# EAGLE design mMWCv0.2 (EAGLE 6.2)
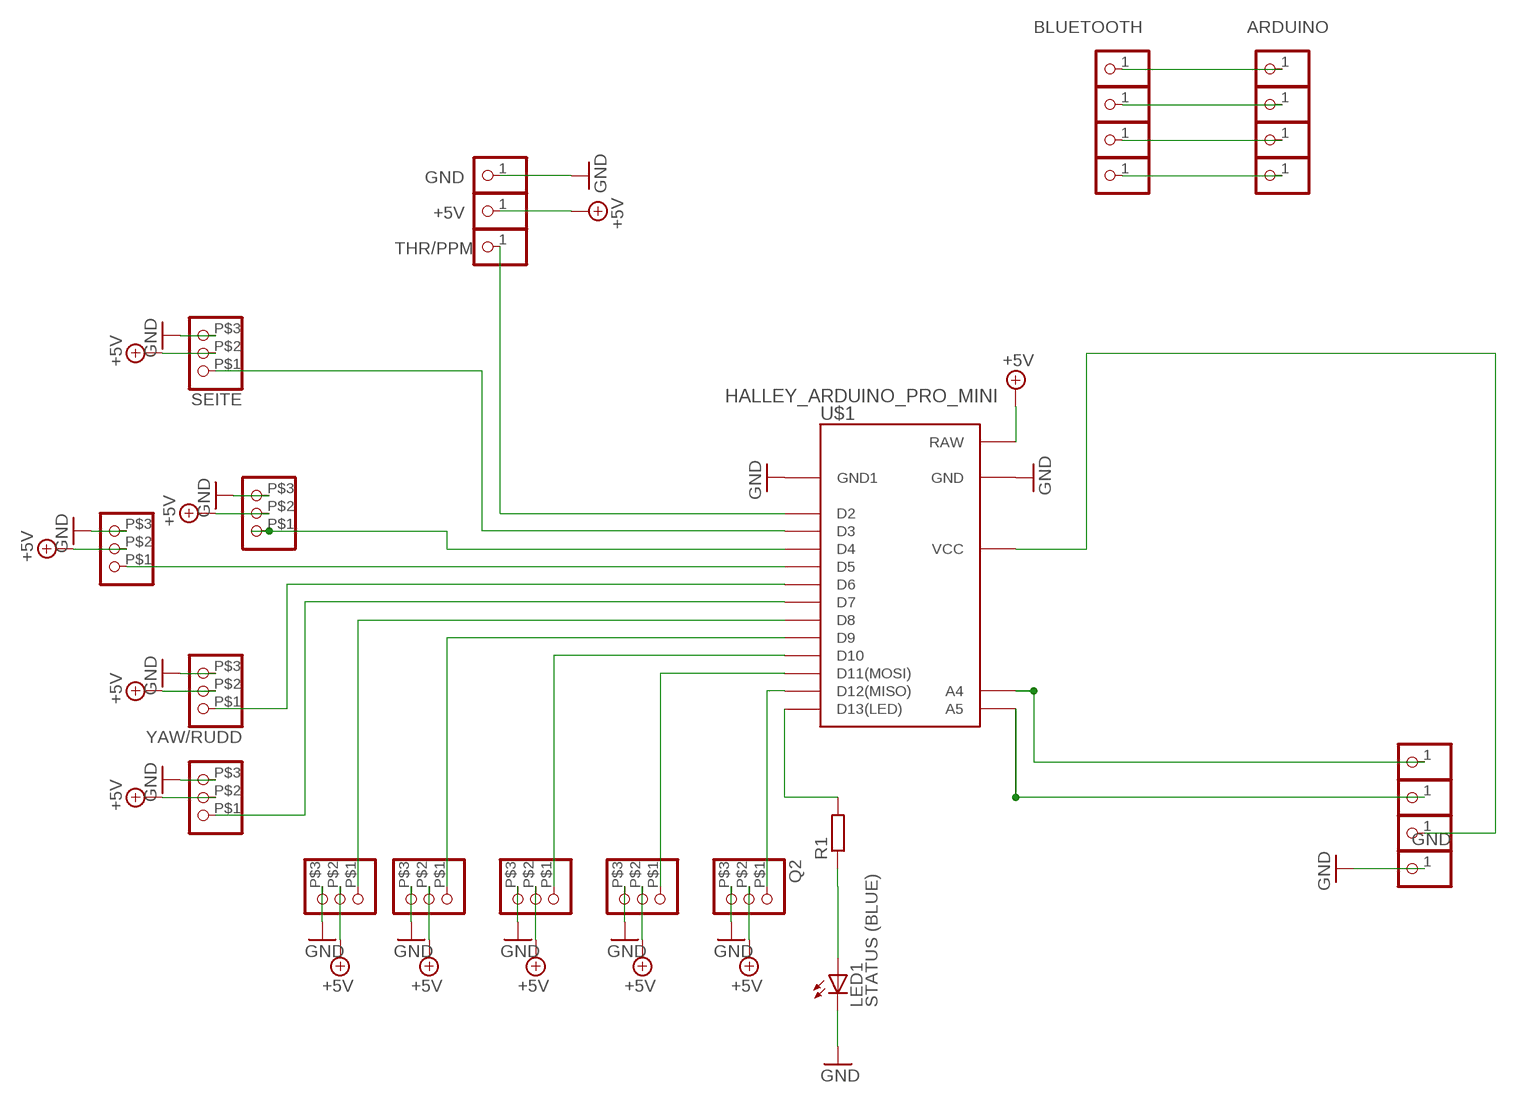
[diagram p0: schematic, sheet 1]

## Parts
5V  PINHD-1X1  [1X01]
+5V  PINHD-1X1  [1X01]
A4  PINHD-1X1  [1X01]
A5  PINHD-1X1  [1X01]
AIL  PINHEAD_PINHD-1X3  [PINHEAD_1X03]
ARD_GND  PINHD-1X1  [1X01]
ARD_RX  PINHD-1X1  [1X01]
ARD_TX  PINHD-1X1  [1X01]
ARD_VCC  GND  PINHD-1X1  [1X01]
AUX2  PINHEAD_PINHD-1X3  [PINHEAD_1X03]
BT_GND  PINHD-1X1  [1X01]
BT_RX  PINHD-1X1  [1X01]
BT_TX  PINHD-1X1  [1X01]
BT_VCC  GND  PINHD-1X1  [1X01]
ELE/PITCH  PINHEAD_PINHD-1X3  [PINHEAD_1X03]
GND  PINHD-1X1  [1X01]
GND_  GND  PINHD-1X1  [1X01]
HÖHE  PINHEAD_PINHD-1X3  [PINHEAD_1X03]
LED1  STATUS (BLUE)  LEDCHIPLED_1206  [CHIPLED_1206]
MODE  PINHEAD_PINHD-1X3  [PINHEAD_1X03]
MOTOR  PINHEAD_PINHD-1X3  [PINHEAD_1X03]
Q1  PINHEAD_PINHD-1X3  [PINHEAD_1X03]
Q2  PINHEAD_PINHD-1X3  [PINHEAD_1X03]
R1  R-EU_R1206  [R1206]
SEITE  PINHEAD_PINHD-1X3  [PINHEAD_1X03]
THR/PPM  PINHD-1X1  [1X01]
U$1  HALLEY_ARDUINO_PRO_MINI  [HALLEY_ARDUINO_PRO_MINI]
YAW/RUDD  PINHEAD_PINHD-1X3  [PINHEAD_1X03]

## Nets
+5V [Power]: +5V.1 AIL.P$2 AUX2.P$2 ELE/PITCH.P$2 HÖHE.P$2 MODE.P$2 MOTOR.P$2 Q1.P$2 Q2.P$2 SEITE.P$2 U$1.RAW YAW/RUDD.P$2
BT_ARD_GND: ARD_GND.1 BT_GND.1
BT_ARD_VCC: ARD_VCC.1 BT_VCC.1
GND [Ground]: AIL.P$3 AUX2.P$3 ELE/PITCH.P$3 GND.1 GND_.1 HÖHE.P$3 LED1.C MODE.P$3 MOTOR.P$3 Q1.P$3 Q2.P$3 SEITE.P$3 U$1.GND1(GND) U$1.GND(GND1) YAW/RUDD.P$3
N$1: THR/PPM.1 U$1.D2
N$2: AIL.P$1 U$1.D4
N$3: SEITE.P$1 U$1.D3
N$4: ELE/PITCH.P$1 U$1.D5
N$5: MODE.P$1 U$1.D7
N$6: Q2.P$1 U$1.D12(D12(MISO))
N$7: AUX2.P$1 U$1.D8
N$8: A4.1 U$1.A4
N$9: R1.2 U$1.D13(D13(LED))
N$10: U$1.D6 YAW/RUDD.P$1
N$11: MOTOR.P$1 U$1.D9
N$12: HÖHE.P$1 U$1.D10
N$13: Q1.P$1 U$1.D11(D11(MOSI))
N$16: LED1.A R1.1
N$17 [Power]: 5V.1 U$1.VCC
N$19: A5.1 U$1.A5
N$20: ARD_RX.1 BT_TX.1
N$21: ARD_TX.1 BT_RX.1

## Notes on the sheet
- BLUETOOTH | ARDUINO

## Library data of the parts
5V +5V A4 A5 ARD_GND ARD_RX ARD_TX ARD_VCC BT_GND BT_RX BT_TX BT_VCC GND GND_ THR/PPM = pinhead:PINHD-1X1: PIN HEADER
AIL AUX2 ELE/PITCH HÖHE MODE MOTOR Q1 Q2 SEITE YAW/RUDD = koneMWC_MiniShield_minimalistic_rearranged:PINHEAD_PINHD-1X3: PIN HEADER
LED1 = led:LED: LED OSRAM: - CHIPLED LG R971, LG N971, LY N971, LG Q971, LY Q971, LO R971, LY R971 LH N974, LH R974 LS Q976, LO Q976, LY Q976 LO Q996 - Hyper CHIPLED LW Q18S LB Q993, LB Q99A, LB R99A - SideLED LS A670, LO A670, LY A670, LG A670, LP A670 LB A673, LV A673, LT A673, LW A673 LH A674 LY A675 LS A676, LA A676, LO A676, LY A676, LW A676 LS A679, LY A679, LG A679 - Hyper Micro SIDELED® LS Y876, LA Y876, LO Y876, LY Y876 LT Y87S - SmartLED LW L88C, LW L88S LB L89C, LB L89S, LG L890 LS L89K, LO L89K, LY L89K LS L896, LA L896, LO L896, LY L896 - TOPLED LS T670, LO T670, LY T670, LG T670, LP T670 LSG T670, LSP T670, LSY T670, LOP T670, LYG T670 LG T671, LOG T671, LSG T671 LB T673, LV T673, LT T673, LW T673 LH T674 LS T676, LA T676, LO T676, LY T676, LB T676, LH T676, LSB T676, LW T676 LB T67C, LV T67C, LT T67C, LS T67K, LO T67K, LY T67K, LW E67C LS E67B, LA E67B, LO E67B, LY E67B, LB E67C, LV E67C, LT E67C LW T67C LS T679, LY T679, LG T679 LS T770, LO T770, LY T770, LG T770, LP T770 LB T773, LV T773, LT T773, LW T773 LH T774 LS E675, LA E675, LY E675, LS T675 LS T776, LA T776, LO T776, LY T776, LB T776 LHGB T686 LT T68C, LB T68C - Hyper Mini TOPLED® LB M676 - Mini TOPLED Santana® LG M470 LS M47K, LO M47K, LY M47K Source: http://www.osram.convergy.de LUXEON: - LUMILED® LXK2-PW12-R00, LXK2-PW12-S00, LXK2-PW14-U00, LXK2-PW14-V00 LXK2-PM12-R00, LXK2-PM12-S00, LXK2-PM14-U00 LXK2-PE12-Q00, LXK2-PE12-R00, LXK2-PE12-S00, LXK2-PE14-T00, LXK2-PE14-U00 LXK2-PB12-K00, LXK2-PB12-L00, LXK2-PB12-M00, LXK2-PB14-N00, LXK2-PB14-P00, LXK2-PB14-Q00 LXK2-PR12-L00, LXK2-PR12-M00, LXK2-PR14-Q00, LXK2-PR14-R00 LXK2-PD12-Q00, LXK2-PD12-R00, LXK2-PD12-S00 LXK2-PH12-R00, LXK2-PH12-S00 LXK2-PL12-P00, LXK2-PL12-Q00, LXK2-PL12-R00 Source: www.luxeon.com KINGBRIGHT: KA-3528ASYC Source: www.kingbright.com
R1 = rcl:R-EU_: RESISTOR, European symbol
U$1 = mMWCa:HALLEY_ARDUINO_PRO_MINI

## Net classes
0 Signal: width 0.61 mm
1 Ground: width 0.813 mm
2 Power: width 0.813 mm

## Board
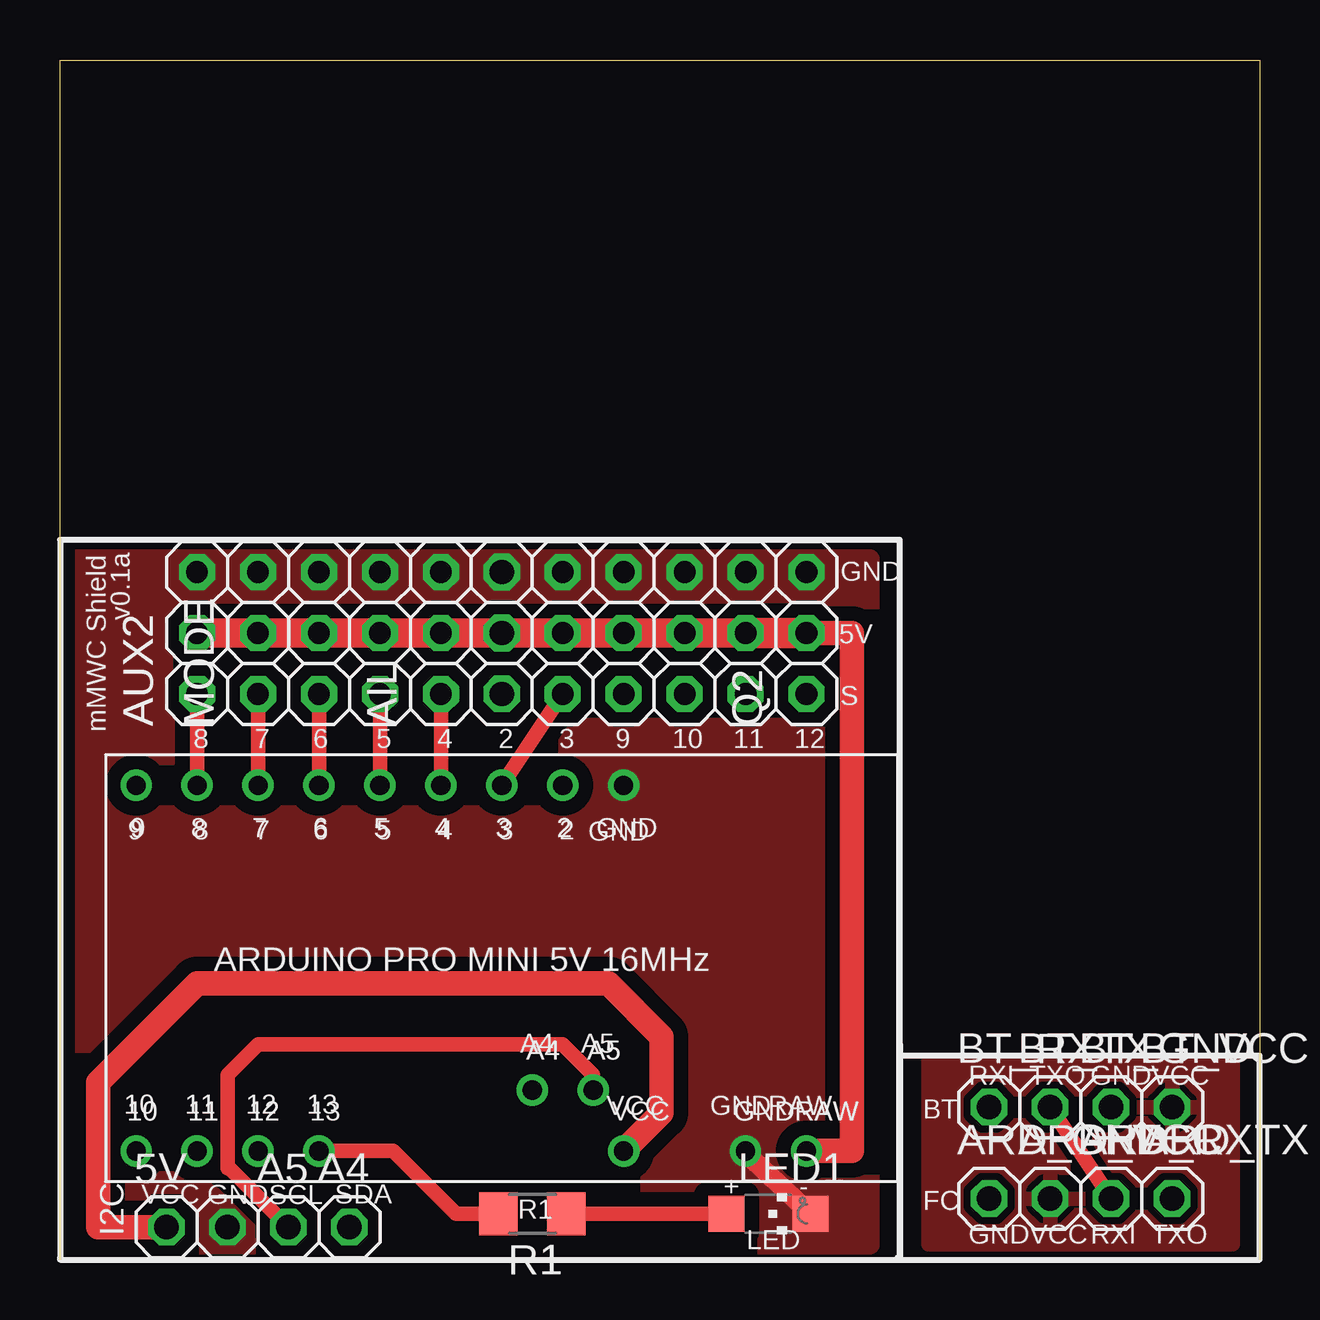
[diagram p1: board, top side]
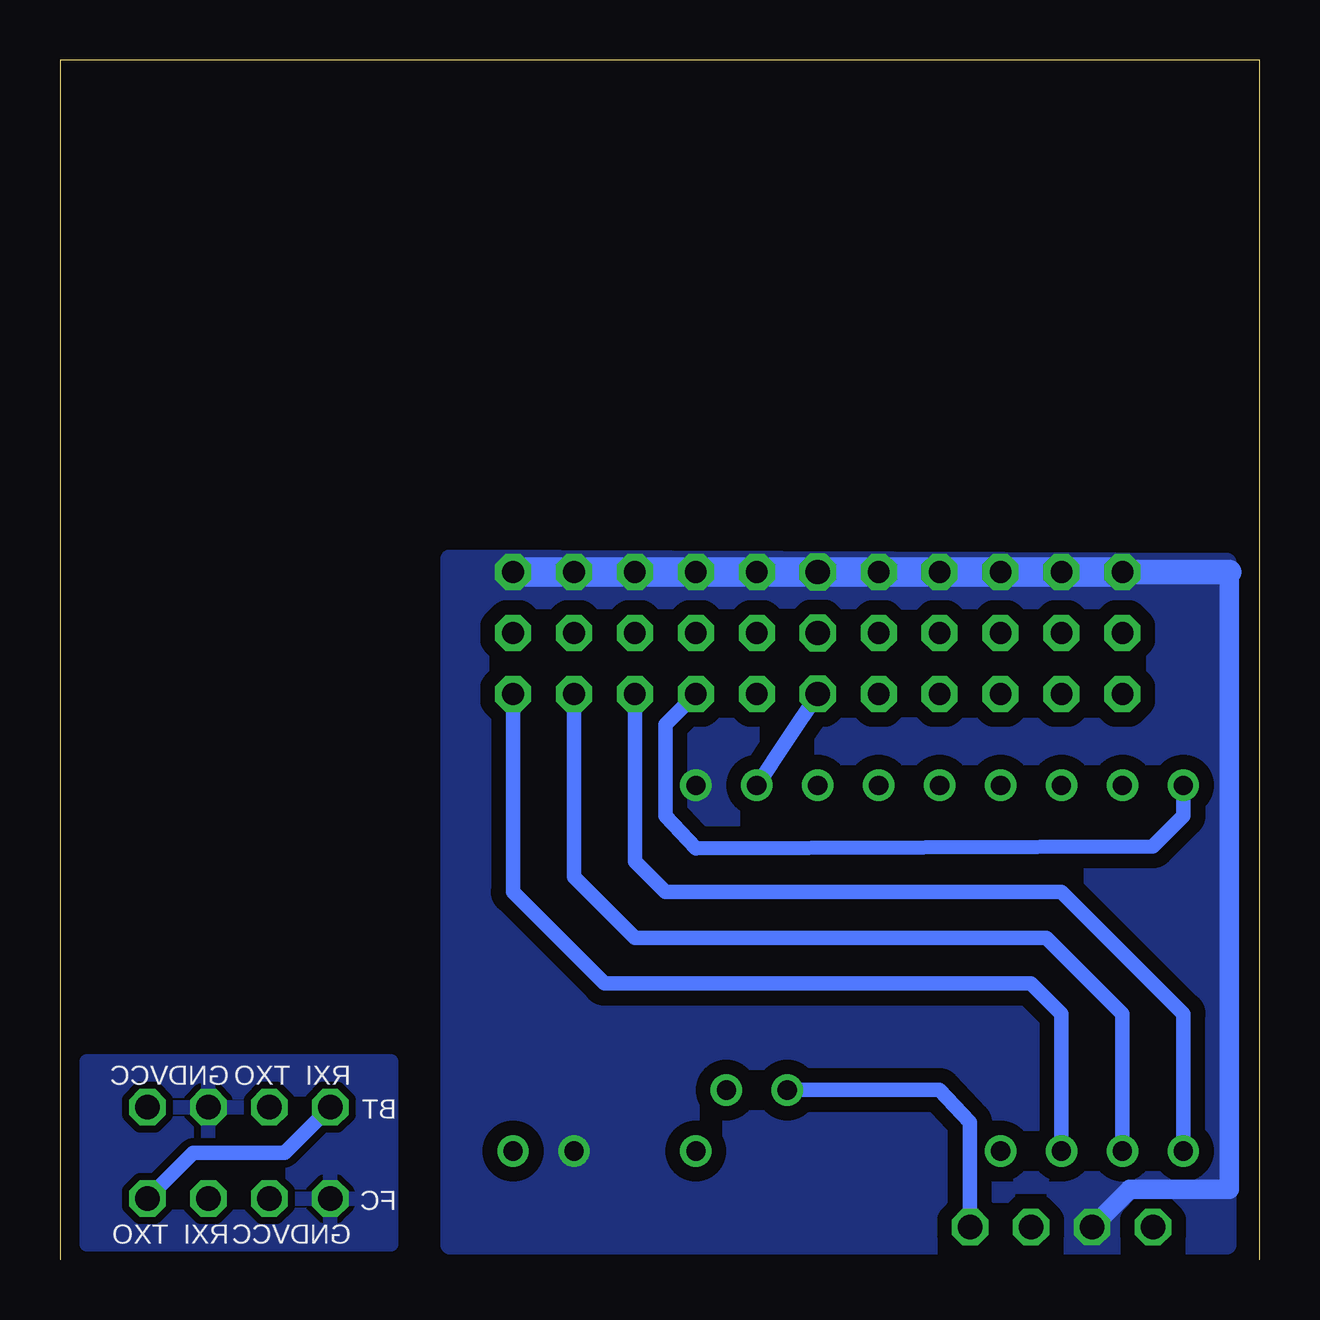
[diagram p2: board, bottom side, seen from below]

Size 50 x 50 mm. Coordinates in mm from the lower left corner, seen from the top.
Outline: 0,0 0,50 50,50 50,0
Copper layers (1*16): Top 0.035mm / dielectric 1.5mm / Bottom 0.035mm
Design rules: minimum track width 6mil, minimum drill 12mil, track to track 12mil, track to pad 12mil, pad to pad 12mil, via to via 12mil, smd to smd 0mil, copper to edge 10mil, drill to drill 10mil, minimum pad ring 10mil, minimum via ring 6mil, stop-mask expansion 2mil, vias tented up to drill 100mil, thermal gap 10mil

### Footprints (pad centres in the part's own frame; a part is rotated, then mirrored left to right if it is on the bottom)
1X01 = drill 1.016 octagon: 1 0,0
PINHEAD_1X03 = drill 0.9 pad 1.5 octagon: P$1 -2.54,0; P$2 0,0; P$3 2.54,0
CHIPLED_1206 = smd 1.5 x 1.5: A 0,-1.75; C 0,1.75
R1206 = smd 1.6 x 1.803: 1 -1.422,0; 2 1.422,0
HALLEY_ARDUINO_PRO_MINI = drill 0.8: A4 0,-5.08; A5 2.54,-5.08; D2 1.27,7.62; D3 -1.27,7.62; D4 -3.81,7.62; D5 -6.35,7.62; D6 -8.89,7.62; D7 -11.43,7.62; D8 -13.97,7.62; D9 -16.51,7.62; D10 -16.51,-7.62; D11 -13.97,-7.62; D12 -11.43,-7.62; D13 -8.89,-7.62; GND 3.81,7.62; GND1 8.89,-7.62; RAW 11.43,-7.62; VCC 3.81,-7.62

### Placement (x,y rotation side)
5V  4.45,1.35 0 top
+5V  18.41,26.11 90 top
A4  12.06,1.35 0 top
A5  9.53,1.35 0 top
AIL  15.88,26.11 90 top
ARD_GND  38.73,2.54 0 top
ARD_RX  43.81,2.54 0 top
ARD_TX  46.35,2.54 0 top
ARD_VCC  41.27,2.54 0 top
AUX2  5.71,26.11 90 top
BT_GND  43.81,6.35 0 top
BT_RX  38.73,6.35 0 top
BT_TX  41.27,6.35 0 top
BT_VCC  46.35,6.35 0 top
ELE/PITCH  13.34,26.11 90 top
GND  18.41,28.66 90 top
GND_  6.99,1.35 0 top
HÖHE  26.04,26.11 90 top
LED1  29.53,1.91 270 top
MODE  8.26,26.11 90 top
MOTOR  23.5,26.11 90 top
Q1  28.57,26.11 90 top
Q2  31.11,26.11 90 top
R1  19.68,1.91 180 top
SEITE  20.95,26.11 90 top
THR/PPM  18.41,23.57 90 top
U$1  19.68,12.14 0 top
YAW/RUDD  10.79,26.11 90 top

### Tracks (layer width: path | path; a pad name or v marks a point on that pad's centre or on a via)
+5V
  Top 1.016: Q2.P$2 33.02,26.11 33.02,4.53 U$1.RAW
  Top 1.219: Q1.P$2 HÖHE.P$2 SEITE.P$2 +5V.1 AIL.P$2 ELE/PITCH.P$2 YAW/RUDD.P$2 MODE.P$2 AUX2.P$2 MOTOR.P$2
  Top 1.27: Q1.P$2 Q2.P$2
BT_ARD_GND
  pour Bottom: 36.2,8.26 48.9,8.26 48.9,0.64 36.2,0.64
BT_ARD_VCC
  pour Top: 36.2,8.26 48.9,8.26 48.9,0.64 36.2,0.64
GND
  Top 0.813: 28.57,4.45 LED1.C 28.57,4.45
  Bottom 0.813: GND_.1 5.4,2.94 1.27,2.94 1.27,28.66
  Bottom 1.016: AUX2.P$3 1.91,28.66 1.27,28.66
  Bottom 1.219: Q2.P$3 Q1.P$3 HÖHE.P$3 SEITE.P$3 GND.1 AIL.P$3 ELE/PITCH.P$3 YAW/RUDD.P$3 MODE.P$3 AUX2.P$3 MOTOR.P$3
  pour Top (isolate 0.61, no thermals): 0.1,29.2 0.1,0.62 33.75,0.62 33.75,29.2
  pour Bottom (isolate 0.61, no thermals): 33.75,29.2 1.36,29.06 1.36,0.62 33.75,0.62
N$1
  Bottom 0.61: THR/PPM.1 19.68,21.67 U$1.D2
N$2
  Top 0.61: U$1.D4 AIL.P$1
N$3
  Top 0.61: U$1.D3 SEITE.P$1
N$4
  Top 0.61: U$1.D5 ELE/PITCH.P$1
N$5
  Top 0.61: U$1.D7 MODE.P$1
N$6
  Bottom 0.61: Q2.P$1 31.11,15.32 27.3,11.51 9.53,11.51 8.26,10.24 U$1.D12
N$7
  Top 0.61: U$1.D8 AUX2.P$1
N$8
  Bottom 0.61: A4.1 12.06,5.71 13.34,7.07 U$1.A4
N$9
  Top 0.61: U$1.D13 13.89,4.53 14.61,3.81 16.51,1.91 R1.2
N$10
  Top 0.61: U$1.D6 YAW/RUDD.P$1
N$11
  Bottom 0.61: U$1.D9 3.17,18.5 4.45,17.23 23.5,17.14 24.77,18.5 24.77,22.3 MOTOR.P$1
N$12
  Bottom 0.61: U$1.D10 3.17,10.24 8.26,15.32 24.77,15.32 26.04,16.59 26.04,19.77 HÖHE.P$1
N$13
  Bottom 0.61: 28.57,16.59 28.57,15.96 | 28.57,15.96 26.04,13.41 8.89,13.41 5.71,10.24 U$1.D11 | 28.57,16.59 28.57,15.96 | 28.57,15.96 28.57,16.59 | 28.57,16.59 28.57,19.77 | 28.57,19.77 28.57,16.59 | 28.57,16.59 28.57,15.96 | 28.57,15.96 28.57,16.59 | 28.57,16.59 28.57,15.96 | 28.57,15.96 28.57,16.59 | 28.57,16.59 28.57,19.77 | 28.57,19.77 Q1.P$1
N$16
  Top 0.61: R1.1 LED1.A
N$17
  Top 1.016: U$1.VCC 25.08,6.11 25.08,8.97 25.08,9.29 22.86,11.51 5.71,11.51 | 5.71,11.51 6.03,11.51 5.71,11.51 | 5.71,11.51 1.59,7.38 1.59,1.35 5V.1
N$19
  Top 0.61: A5.1 7.94,2.94 6.99,3.89 | 6.99,3.89 6.99,3.81 6.99,3.89 | 6.99,3.89 6.99,7.7 8.26,8.97 13.34,8.97 19.68,8.97 20.95,8.97 22.23,7.7 U$1.A5
N$20
  Top 0.61: BT_TX.1 ARD_RX.1
N$21
  Bottom 0.61: BT_RX.1 40.01,5.08 40.64,4.45 44.45,4.45 ARD_TX.1

### Text on the board
_tsilk: v0.1a | GND | 5V | S | mMWC Shield | 8 | 7 | 6 | 5 | 4 | 2 | 3 | 9 | 10 | 11 | 12 | 9 | 8 | 7 | 6 | 5 | 4 | 3 | 2 | GND | ARDUINO PRO MINI 5V 16MHz | A4 | A5 | RXI | TXO | GND | VCC | 10 | 11 | 12 | 13 | VCC | GND | RAW | BT | + | - | VCC | GND | SCL | SDA | R1 | FC | I2C | GND | VCC | RXI | TXO | LED
_bsilk: RXI | TXO | GND | VCC | BT | FC | GND | VCC | RXI | TXO